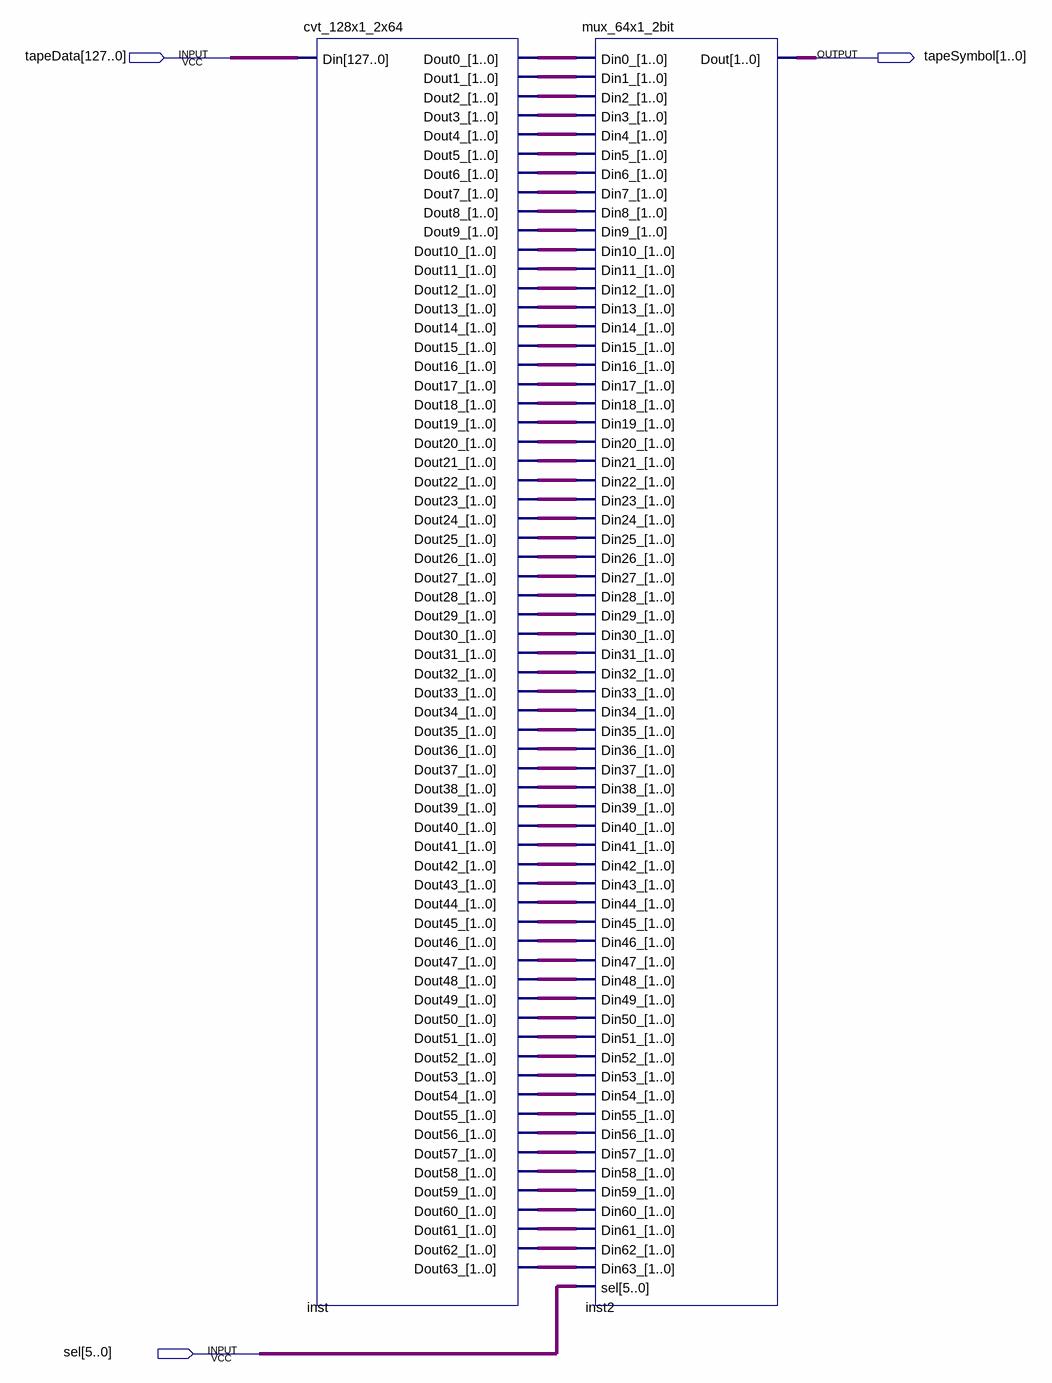
[diagram p0: schematic sheet]
// Quartus schematic tapeSymbolFinder.bdf as structural Verilog: 2 symbols, 3 pins
module tapeSymbolFinder (
  input  [127:0] tapeData,
  input  [5:0] sel,
  output [1:0] tapeSymbol
);

  wire [1:0] inst_dout0_, inst_dout1_, inst_dout2_, inst_dout3_, inst_dout4_, inst_dout5_, inst_dout6_,
       inst_dout7_, inst_dout8_, inst_dout9_, inst_dout10_, inst_dout11_, inst_dout12_, inst_dout13_,
       inst_dout14_, inst_dout15_, inst_dout16_, inst_dout17_, inst_dout18_, inst_dout19_, inst_dout20_,
       inst_dout21_, inst_dout22_, inst_dout23_, inst_dout24_, inst_dout25_, inst_dout26_, inst_dout27_,
       inst_dout28_, inst_dout29_, inst_dout30_, inst_dout31_, inst_dout32_, inst_dout33_, inst_dout34_,
       inst_dout35_, inst_dout36_, inst_dout37_, inst_dout38_, inst_dout39_, inst_dout40_, inst_dout41_,
       inst_dout42_, inst_dout43_, inst_dout44_, inst_dout45_, inst_dout46_, inst_dout47_, inst_dout48_,
       inst_dout49_, inst_dout50_, inst_dout51_, inst_dout52_, inst_dout53_, inst_dout54_, inst_dout55_,
       inst_dout56_, inst_dout57_, inst_dout58_, inst_dout59_, inst_dout60_, inst_dout61_, inst_dout62_,
       inst_dout63_;

  cvt_128x1_2x64 inst (
    .Din(tapeData), .Dout0_(inst_dout0_), .Dout1_(inst_dout1_), .Dout2_(inst_dout2_), .Dout3_(inst_dout3_),
    .Dout4_(inst_dout4_), .Dout5_(inst_dout5_), .Dout6_(inst_dout6_), .Dout7_(inst_dout7_),
    .Dout8_(inst_dout8_), .Dout9_(inst_dout9_), .Dout10_(inst_dout10_), .Dout11_(inst_dout11_),
    .Dout12_(inst_dout12_), .Dout13_(inst_dout13_), .Dout14_(inst_dout14_), .Dout15_(inst_dout15_),
    .Dout16_(inst_dout16_), .Dout17_(inst_dout17_), .Dout18_(inst_dout18_), .Dout19_(inst_dout19_),
    .Dout20_(inst_dout20_), .Dout21_(inst_dout21_), .Dout22_(inst_dout22_), .Dout23_(inst_dout23_),
    .Dout24_(inst_dout24_), .Dout25_(inst_dout25_), .Dout26_(inst_dout26_), .Dout27_(inst_dout27_),
    .Dout28_(inst_dout28_), .Dout29_(inst_dout29_), .Dout30_(inst_dout30_), .Dout31_(inst_dout31_),
    .Dout32_(inst_dout32_), .Dout33_(inst_dout33_), .Dout34_(inst_dout34_), .Dout35_(inst_dout35_),
    .Dout36_(inst_dout36_), .Dout37_(inst_dout37_), .Dout38_(inst_dout38_), .Dout39_(inst_dout39_),
    .Dout40_(inst_dout40_), .Dout41_(inst_dout41_), .Dout42_(inst_dout42_), .Dout43_(inst_dout43_),
    .Dout44_(inst_dout44_), .Dout45_(inst_dout45_), .Dout46_(inst_dout46_), .Dout47_(inst_dout47_),
    .Dout48_(inst_dout48_), .Dout49_(inst_dout49_), .Dout50_(inst_dout50_), .Dout51_(inst_dout51_),
    .Dout52_(inst_dout52_), .Dout53_(inst_dout53_), .Dout54_(inst_dout54_), .Dout55_(inst_dout55_),
    .Dout56_(inst_dout56_), .Dout57_(inst_dout57_), .Dout58_(inst_dout58_), .Dout59_(inst_dout59_),
    .Dout60_(inst_dout60_), .Dout61_(inst_dout61_), .Dout62_(inst_dout62_), .Dout63_(inst_dout63_));
  mux_64x1_2bit inst2 (
    .Din0_(inst_dout0_), .Din1_(inst_dout1_), .Din2_(inst_dout2_), .Din3_(inst_dout3_), .Din4_(inst_dout4_),
    .Din5_(inst_dout5_), .Din6_(inst_dout6_), .Din7_(inst_dout7_), .Din8_(inst_dout8_), .Din9_(inst_dout9_),
    .Din10_(inst_dout10_), .Din11_(inst_dout11_), .Din12_(inst_dout12_), .Din13_(inst_dout13_),
    .Din14_(inst_dout14_), .Din15_(inst_dout15_), .Din16_(inst_dout16_), .Din17_(inst_dout17_),
    .Din18_(inst_dout18_), .Din19_(inst_dout19_), .Din20_(inst_dout20_), .Din21_(inst_dout21_),
    .Din22_(inst_dout22_), .Din23_(inst_dout23_), .Din24_(inst_dout24_), .Din25_(inst_dout25_),
    .Din26_(inst_dout26_), .Din27_(inst_dout27_), .Din28_(inst_dout28_), .Din29_(inst_dout29_),
    .Din30_(inst_dout30_), .Din31_(inst_dout31_), .Din32_(inst_dout32_), .Din33_(inst_dout33_),
    .Din34_(inst_dout34_), .Din35_(inst_dout35_), .Din36_(inst_dout36_), .Din37_(inst_dout37_),
    .Din38_(inst_dout38_), .Din39_(inst_dout39_), .Din40_(inst_dout40_), .Din41_(inst_dout41_),
    .Din42_(inst_dout42_), .Din43_(inst_dout43_), .Din44_(inst_dout44_), .Din45_(inst_dout45_),
    .Din46_(inst_dout46_), .Din47_(inst_dout47_), .Din48_(inst_dout48_), .Din49_(inst_dout49_),
    .Din50_(inst_dout50_), .Din51_(inst_dout51_), .Din52_(inst_dout52_), .Din53_(inst_dout53_),
    .Din54_(inst_dout54_), .Din55_(inst_dout55_), .Din56_(inst_dout56_), .Din57_(inst_dout57_),
    .Din58_(inst_dout58_), .Din59_(inst_dout59_), .Din60_(inst_dout60_), .Din61_(inst_dout61_),
    .Din62_(inst_dout62_), .Din63_(inst_dout63_), .sel(sel), .Dout(tapeSymbol));
endmodule
